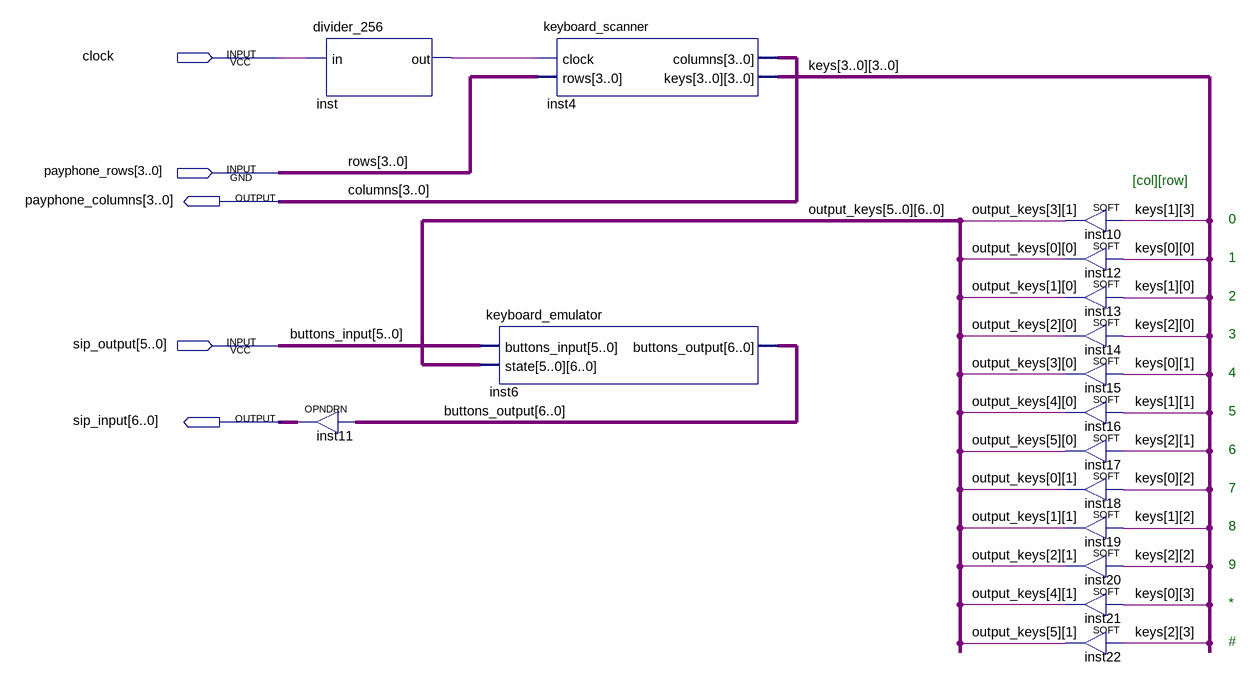
[diagram p0: schematic sheet]
// Quartus schematic main.bdf as structural Verilog: 16 symbols, 5 pins
module main (
  input  clock,
  input  [3:0] payphone_rows,
  input  [5:0] sip_output,
  output [3:0] payphone_columns,
  output [6:0] sip_input
);

  wire inst_out;
  wire [3:0] keys_0, keys_1, keys_2, keys_3;
  wire [6:0] buttons_output, output_keys_0, output_keys_1, output_keys_2, output_keys_3, output_keys_4,
       output_keys_5;

  divider_256 inst (.in(clock), .out(inst_out));
  OPNDRN inst11[6:0] (.IN(buttons_output), .OUT(sip_input));
  keyboard_emulator inst6 (
    .buttons_input(sip_output),
    .state({output_keys_5, output_keys_4, output_keys_3, output_keys_2, output_keys_1, output_keys_0}),
    .buttons_output(buttons_output));
  keyboard_scanner inst4 (
    .clock(inst_out), .rows(payphone_rows), .columns(payphone_columns),
    .keys({keys_3, keys_2, keys_1, keys_0}));
  SOFT inst10 (.IN(keys_1[3]), .OUT(output_keys_3[1]));
  SOFT inst12 (.IN(keys_0[0]), .OUT(output_keys_0[0]));
  SOFT inst13 (.IN(keys_1[0]), .OUT(output_keys_1[0]));
  SOFT inst14 (.IN(keys_2[0]), .OUT(output_keys_2[0]));
  SOFT inst15 (.IN(keys_0[1]), .OUT(output_keys_3[0]));
  SOFT inst16 (.IN(keys_1[1]), .OUT(output_keys_4[0]));
  SOFT inst17 (.IN(keys_2[1]), .OUT(output_keys_5[0]));
  SOFT inst18 (.IN(keys_0[2]), .OUT(output_keys_0[1]));
  SOFT inst19 (.IN(keys_1[2]), .OUT(output_keys_1[1]));
  SOFT inst20 (.IN(keys_2[2]), .OUT(output_keys_2[1]));
  SOFT inst21 (.IN(keys_0[3]), .OUT(output_keys_4[1]));
  SOFT inst22 (.IN(keys_2[3]), .OUT(output_keys_5[1]));

  // Other names for the same wires on the sheet: buttons_input[5:0] = sip_output; columns[3:0] = payphone_columns;
  //   rows[3:0] = payphone_rows

  // Notes on the sheet:
  //   [col][row]
  //   0
  //   1
  //   2
  //   3
  //   4
  //   5
  //   6
  //   7
  //   8
  //   9
  //   *
  //   #
endmodule
